# Altium schematic sheet BANK16.SchDoc: XC7A3G-BANK16
size A4; Date: 9 AUG 2026; Engineer: Parsa Malekpour; Revision: 1.0.0; SheetNumber: 4; SheetTotal: 18
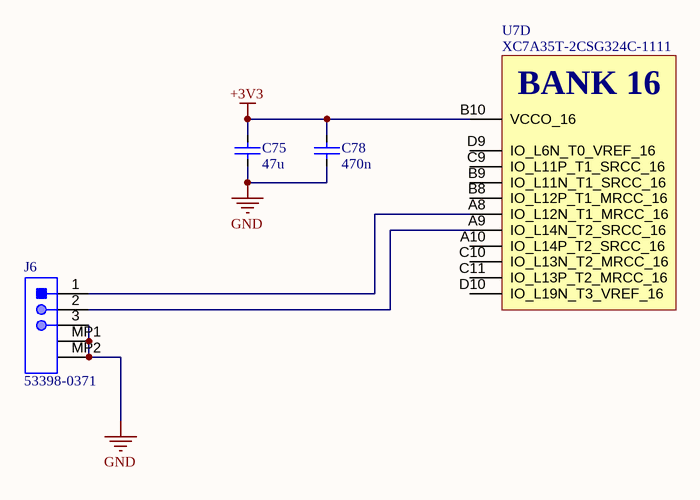
[diagram p0: BANK16.SchDoc]

## Parts
C75  value 47u  [FP-C2012-125-0_2-IPC_C]  (hidden comment: C2012X5R1A476M125AC)
C78  value 470n  [FP-C1005-050-0_05-IPC_C]  (hidden comment: C1005X5R1E474K050BB)
J6  53398-0371  [MOLX-53398-0371_V]
U7  XC7A35T-2CSG324C-1111  [BGA324C80P18X18_1500X1500X150]  (part D of 8)

## Nets
+3V3: C75.1 C78.1 U7.B10(VCCO_16)
GND: C75.2 C78.2 J6.3 J6.MP1 J6.MP2
NetJ6_1: J6.1 U7.A8(IO_L12N_T1_MRCC_16)
NetJ6_2: J6.2 U7.A9(IO_L14N_T2_SRCC_16)

Not connected (* = marked no-connect by the designer): U7 A10(IO_L14P_T2_SRCC_16) B8(IO_L12P_T1_MRCC_16) B9(IO_L11N_T1_SRCC_16) C9(IO_L11P_T1_SRCC_16) C10(IO_L13N_T2_MRCC_16) C11(IO_L13P_T2_MRCC_16) D9(IO_L6N_T0_VREF_16) D10(IO_L19N_T3_VREF_16)

## Notes on the sheet
- TITLE
- REV
- Date
- A4
- FILE NAME
- CODE
- SHEET
- Engineer
- OF
- (in symbol XC7A35T-2CSG324C-1111, part D) BANK 16

## Library data of the parts
C75 = C2012X5R1A476M125AC: 47μF ±20% 10V X5R SMD 0805 Multilayer Ceramic Capacitors; RoHS Compliant: Yes; Dielectric: X5R; Case Code (Imperial): 0805; Min Operating Temperature: -55°C; Length: 2mm; Voltage Rating: 10V; Lead Free: Lead Free; Weight: 0.000194oz; Resistor Type: Ceramic; Dielectric Material: Ceramic; Max Operating Temperature: 85°C; Height: 1.25mm; Width: 0.049inch; Depth: 1.25mm; Termination: SMD/SMT; Case/Package: 0805; Voltage Rating (DC): 10V; Voltage: 10V; Thickness: 0.057inch; Tolerance: 20%; REACH SVHC: No SVHC; Package Quantity: 1; Series: C; Case Code (Metric): 2012; Mount: Surface Mount; Packaging: Tape and Reel; Part Number: C2012X5R1A476M125AC
C78 = C1005X5R1E474K050BB: Multilayer Ceramic Capacitors 470nF ±10% 25V X5R SMD 0402; Dissipation Factor: 10%; Case Code (Metric): 1005; RoHS Compliant: Yes; Lead Free: Lead Free; Length: 1mm; Case/Package: 0402; Termination: SMD/SMT; Dielectric Material: Ceramic; Dielectric: X5R; Depth: 0.5mm; Series: C; Voltage: 25V; Tolerance: 10%; Packaging: Tape and Reel; Resistor Type: Ceramic; Min Operating Temperature: -55°C; Width: 0.02inch; Thickness: 500um; Package Quantity: 10000; Case Code (Imperial): 0402; Construction: Flat; Height: 0.5mm; REACH SVHC: No SVHC; Radiation Hardening: No; Weight: 2.3E-05oz; Mount: Surface Mount; Voltage Rating (DC): 25V; Max Operating Temperature: 85°C; Part Number: C1005X5R1E474K050BB; Voltage Rating: 25V
J6 = 53398-0371: Male Header, Pitch 1.25 mm, 1 x 3 Position, Height 4.7 mm, -40 to 85 degC, RoHS, Tape and Reel; Voltage Rating: 125V; Brand: Molex; Pitch: 1.25mm; Mounting Angle: Vertical; Number of Positions: 3; Current Rating: 1A; Product Type: Headers; Tradename: PicoBlade; Package Reference: 53398-0371; Factory Pack Quantity: 1000; Product Category: Headers&WireHousings; Package Description: Male Header, Pitch 1.25 mm, 1 x 3 Position, Height 4.7 mm; Manufacturer: Molex; Packaging: Reel; Datasheet URL: http://www.molex.com/pdm_docs/sd/533980371_sd.pdf; Type: Shrouded; Manufacturer URL: http://www.molex.com/; Datasheet Version: Rev. J, 09/2015; Number of Positions / Contacts: 3; RoHS: Details; Contact Plating: Tin; Mounting Technology: SurfaceMount; Termination Style: SMD; Housing Material: Nylon; Number of Rows: 1; Mounting Style: SMD/SMT; Series: 53398; Contact Material: PhosphorBronze
U7 = XC7A35T-2CSG324C-1111: Integrated Circuit; Manufacturer_Name: AMD; Datasheet Link: https://www.xilinx.com/support/documentation/data_sheets/ds181_Artix_7_Data_Sheet.pdf; Height: 1.5mm; Manufacturer_Part_Number: XC7A35T-2CSG324C; Mouser Part Number: 217-XC7A35T-2CSG324C; Mouser Price/Stock: https://www.mouser.co.uk/ProductDetail/AMD-Xilinx/XC7A35T-2CSG324C?qs=rrS6PyfT74fMA9%2F3WtPZmw%3D%3D